# Altium project proj_LAB_main.PrjPcb
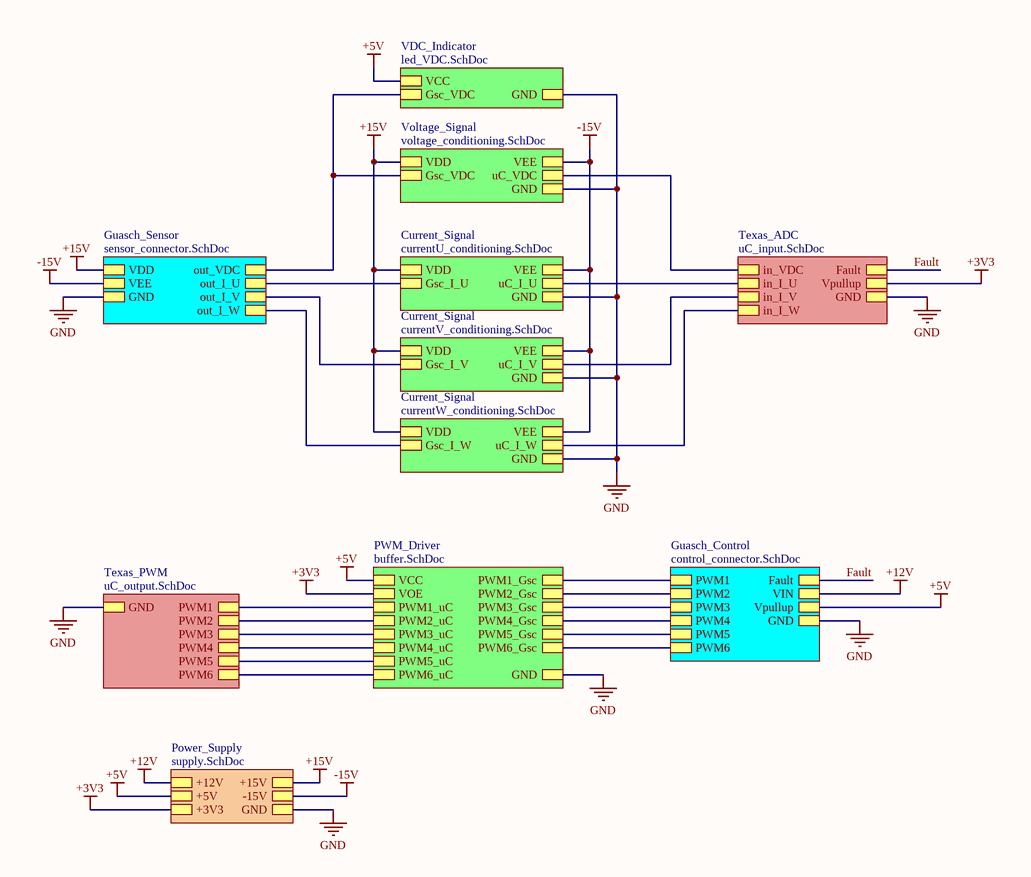
[diagram p0: main.SchDoc]
12 sheets, 130 parts. Net scope: hierarchical (ports join the sheet entries above them; power ports are global).
Sheets:
  main.SchDoc
    PWM_Driver = buffer.SchDoc
    Guasch_Control = control_connector.SchDoc
    Guasch_Sensor = sensor_connector.SchDoc
    Current_Signal = currentU_conditioning.SchDoc
    Voltage_Signal = voltage_conditioning.SchDoc
    Texas_ADC = uC_input.SchDoc
    Texas_PWM = uC_output.SchDoc
    Current_Signal = currentV_conditioning.SchDoc
    Current_Signal = currentW_conditioning.SchDoc
    Power_Supply = supply.SchDoc
    VDC_Indicator = led_VDC.SchDoc

## Sheet main.SchDoc
size A4; SheetNumber: 1; SheetTotal: 12

### Sub-sheets
Current_Signal = currentU_conditioning.SchDoc: Gsc_I_U, uC_I_U, VDD, VEE, GND
Current_Signal = currentV_conditioning.SchDoc: Gsc_I_V, uC_I_V, VDD, VEE, GND
Current_Signal = currentW_conditioning.SchDoc: Gsc_I_W, uC_I_W, VDD, VEE, GND
Guasch_Control = control_connector.SchDoc: PWM1, PWM2, PWM3, Fault, PWM4, PWM5, PWM6, VIN, GND, Vpullup
Guasch_Sensor = sensor_connector.SchDoc: out_I_U, out_I_V, out_I_W, VDD, VEE, GND, out_VDC
Power_Supply = supply.SchDoc: +15V, -15V, +12V, +5V, +3V3, GND
PWM_Driver = buffer.SchDoc: PWM1_uC, PWM2_uC, PWM3_uC, PWM4_uC, PWM5_uC, PWM6_uC, PWM1_Gsc, PWM2_Gsc, PWM3_Gsc, PWM4_Gsc, PWM5_Gsc, PWM6_Gsc, VCC, GND, VOE
Texas_ADC = uC_input.SchDoc: in_VDC, in_I_U, in_I_V, in_I_W, Fault, Vpullup, GND
Texas_PWM = uC_output.SchDoc: PWM1, PWM2, PWM3, PWM4, PWM5, PWM6, GND
VDC_Indicator = led_VDC.SchDoc: VCC, Gsc_VDC, GND
Voltage_Signal = voltage_conditioning.SchDoc: Gsc_VDC, uC_VDC, VDD, VEE, GND

### Nets
+3V3: sheet PWM_Driver/VOE, sheet Texas_ADC/Vpullup, sheet Power_Supply/+3V3
+5V: sheet PWM_Driver/VCC, sheet Guasch_Control/Vpullup, sheet Power_Supply/+5V, sheet VDC_Indicator/VCC
+12V: sheet Guasch_Control/VIN, sheet Power_Supply/+12V
+15V: sheet Guasch_Sensor/VDD, sheet Current_Signal/VDD, sheet Voltage_Signal/VDD, sheet Current_Signal/VDD, sheet Current_Signal/VDD, sheet Power_Supply/+15V
-15V: sheet Guasch_Sensor/VEE, sheet Current_Signal/VEE, sheet Voltage_Signal/VEE, sheet Current_Signal/VEE, sheet Current_Signal/VEE, sheet Power_Supply/-15V
GND: sheet PWM_Driver/GND, sheet Guasch_Control/GND, sheet Guasch_Sensor/GND, sheet Current_Signal/GND, sheet Voltage_Signal/GND, sheet Texas_ADC/GND, sheet Texas_PWM/GND, sheet Current_Signal/GND, sheet Current_Signal/GND, sheet Power_Supply/GND, sheet VDC_Indicator/GND
A/D A2: sheet Voltage_Signal/uC_VDC, sheet Texas_ADC/in_VDC
A/D A3: sheet Current_Signal/uC_I_U, sheet Texas_ADC/in_I_U
A/D A4: sheet Texas_ADC/in_I_V, sheet Current_Signal/uC_I_V
A/D A5: sheet Texas_ADC/in_I_W, sheet Current_Signal/uC_I_W
Fault: sheet Guasch_Control/Fault, sheet Texas_ADC/Fault
Gsc_VDC: sheet Guasch_Sensor/out_VDC, sheet Voltage_Signal/Gsc_VDC, sheet VDC_Indicator/Gsc_VDC
PWM1A: sheet PWM_Driver/PWM1_uC, sheet Texas_PWM/PWM1
PWM2A: sheet PWM_Driver/PWM2_uC, sheet Texas_PWM/PWM2
PWM3A: sheet PWM_Driver/PWM3_uC, sheet Texas_PWM/PWM3
PWM4A: sheet PWM_Driver/PWM4_uC, sheet Texas_PWM/PWM4
PWM5A: sheet PWM_Driver/PWM5_uC, sheet Texas_PWM/PWM5
PWM6A: sheet PWM_Driver/PWM6_uC, sheet Texas_PWM/PWM6
NetIC?#1_3: sheet PWM_Driver/PWM1_Gsc, sheet Guasch_Control/PWM1
NetIC?#1_5: sheet PWM_Driver/PWM2_Gsc, sheet Guasch_Control/PWM2
NetIC?#1_7: sheet PWM_Driver/PWM3_Gsc, sheet Guasch_Control/PWM3
NetIC?#1_9: sheet PWM_Driver/PWM4_Gsc, sheet Guasch_Control/PWM4
NetIC?#1_11: sheet PWM_Driver/PWM5_Gsc, sheet Guasch_Control/PWM5
NetIC?#1_13: sheet PWM_Driver/PWM6_Gsc, sheet Guasch_Control/PWM6
NetJ?#2_3: sheet Guasch_Sensor/out_I_U, sheet Current_Signal/Gsc_I_U
NetJ?#2_4: sheet Guasch_Sensor/out_I_V, sheet Current_Signal/Gsc_I_V
NetJ?#2_5: sheet Guasch_Sensor/out_I_W, sheet Current_Signal/Gsc_I_W

## Sheet buffer.SchDoc
size A4; SheetNumber: 8; SheetTotal: 12
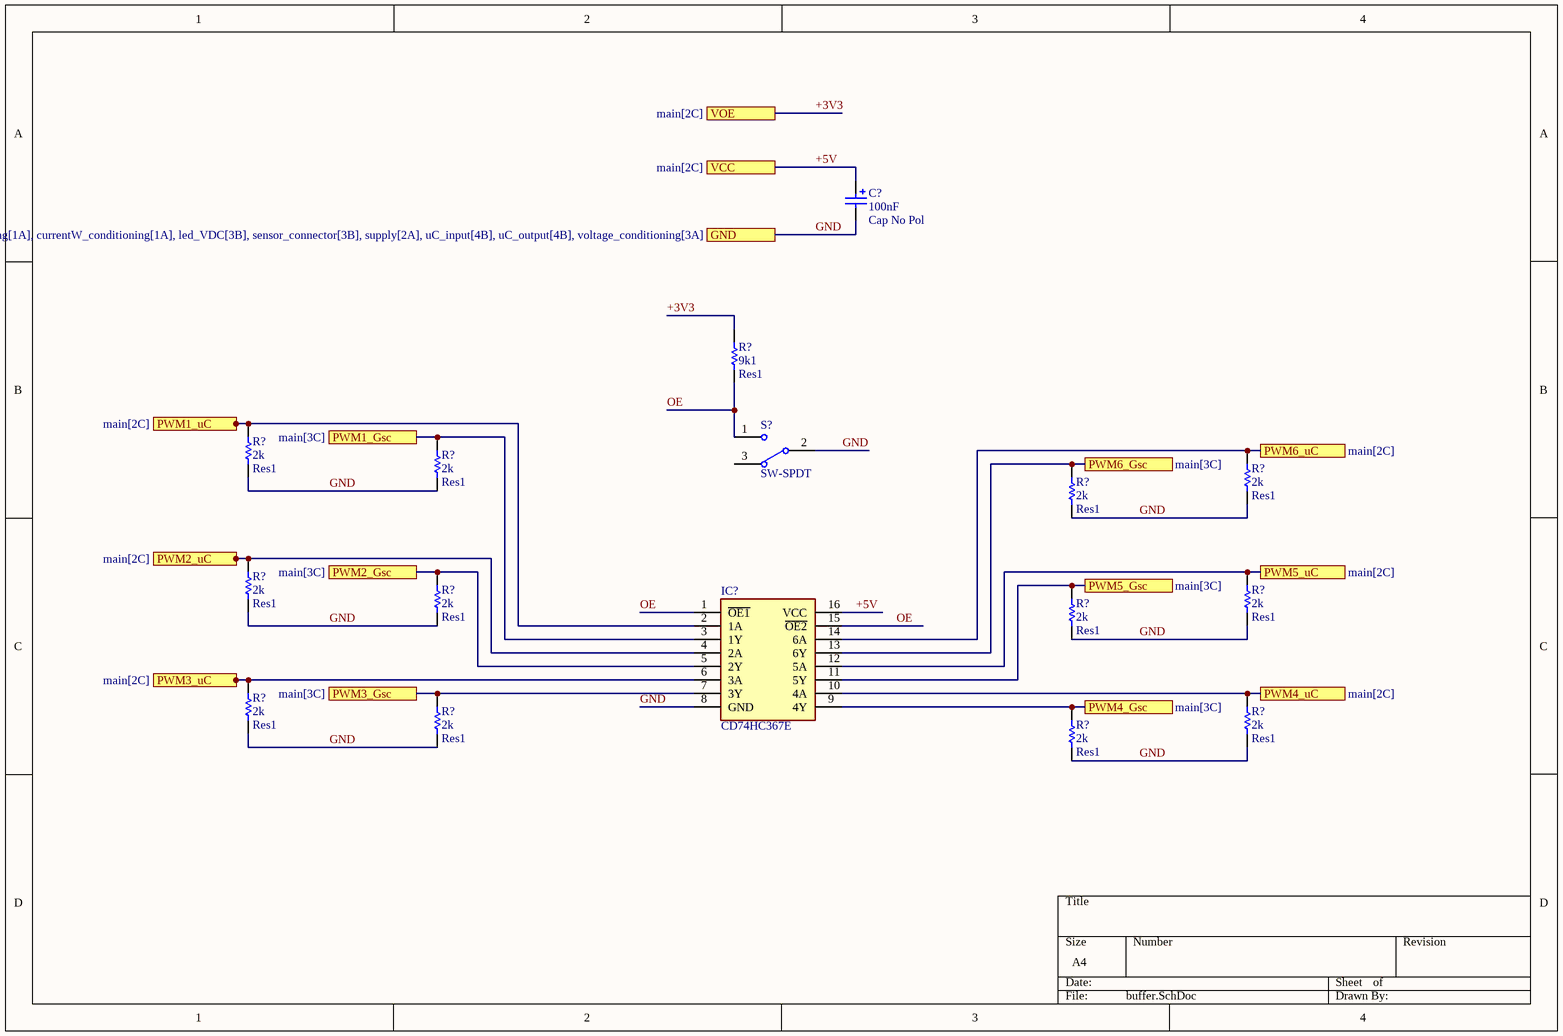
[diagram p1: buffer.SchDoc]

### Parts
(Parts that share a designator on the sheet are numbered #1, #2 ... from top to bottom, then left to right.)
C?#1  Cap No Pol  value 100nF  [RAD-0.1]
IC?#1  CD74HC367E  [DIP794W53P254L1930H508Q16N]
R?#1  Res1  value 9k1  [AXIAL-0.3]
R?#2  Res1  value 2k  [AXIAL-0.3]
R?#3  Res1  value 2k  [AXIAL-0.3]
R?#4  Res1  value 2k  [AXIAL-0.3]
R?#5  Res1  value 2k  [AXIAL-0.3]
R?#6  Res1  value 2k  [AXIAL-0.3]
R?#7  Res1  value 2k  [AXIAL-0.3]
R?#8  Res1  value 2k  [AXIAL-0.3]
R?#9  Res1  value 2k  [AXIAL-0.3]
R?#10  Res1  value 2k  [AXIAL-0.3]
R?#11  Res1  value 2k  [AXIAL-0.3]
R?#12  Res1  value 2k  [AXIAL-0.3]
R?#13  Res1  value 2k  [AXIAL-0.3]
S?#1  SW-SPDT  [MHDR1X3]

### Ports
GND (see main[3C], control_connector[2D], currentU_conditioning[1A], currentV_conditioning[1A], currentW_conditioning[1A], led_VDC[3B], sensor_connector[3B], supply[2A], uC_input[4B], uC_output[4B], voltage_conditioning[3A]), PWM1_Gsc (see main[3C]), PWM1_uC (see main[2C]), PWM2_Gsc (see main[3C]), PWM2_uC (see main[2C]), PWM3_Gsc (see main[3C]), PWM3_uC (see main[2C]), PWM4_Gsc (see main[3C]), PWM4_uC (see main[2C]), PWM5_Gsc (see main[3C]), PWM5_uC (see main[2C]), PWM6_Gsc (see main[3C]), PWM6_uC (see main[2C]), VCC (see main[2C]), VOE (see main[2C])

### Nets
+3V3: R?#1.2 ; port VOE
+5V: C?#1.1 IC?#1.16(VCC) ; port VCC
GND: C?#1.2 IC?#1.8(GND) R?#2.1 R?#3.1 R?#4.1 R?#5.1 R?#6.1 R?#7.1 R?#8.1 R?#9.1 R?#10.1 R?#11.1 R?#12.1 R?#13.1 S?#1.2 ; port GND
OE: IC?#1.1(~{OE1}) IC?#1.15(~{OE2}) R?#1.1 S?#1.1
PWM1A: IC?#1.2(1A) R?#2.2 ; port PWM1_uC
PWM2A: IC?#1.4(2A) R?#6.2 ; port PWM2_uC
PWM3A: IC?#1.6(3A) R?#10.2 ; port PWM3_uC
PWM4A: IC?#1.10(4A) R?#12.2 ; port PWM4_uC
PWM5A: IC?#1.12(5A) R?#8.2 ; port PWM5_uC
PWM6A: IC?#1.14(6A) R?#4.2 ; port PWM6_uC
NetIC?#1_3: IC?#1.3(1Y) R?#3.2 ; port PWM1_Gsc
NetIC?#1_5: IC?#1.5(2Y) R?#7.2 ; port PWM2_Gsc
NetIC?#1_7: IC?#1.7(3Y) R?#11.2 ; port PWM3_Gsc
NetIC?#1_9: IC?#1.9(4Y) R?#13.2 ; port PWM4_Gsc
NetIC?#1_11: IC?#1.11(5Y) R?#9.2 ; port PWM5_Gsc
NetIC?#1_13: IC?#1.13(6Y) R?#5.2 ; port PWM6_Gsc

Not connected (* = marked no-connect by the designer): S?#1 3

### Library data of the parts
C?#1 = Cap No Pol: Polarized Capacitor (Radial); Published: 8-Jun-2000; LatestRevisionDate: 17-Jul-2002; LatestRevisionNote: Re-released for DXP Platform.; PackageReference: RB7.6-15; Publisher: Altium Limited; PackageDescription: Polarized Capacitor (Radial); 2 Leads
IC?#1 = CD74HC367E: Integrated Circuit; Manufacturer_Name: Texas Instruments; Datasheet Link: https://www.ti.com/lit/ds/symlink/cd74hc367.pdf?ts=1619589374451&ref_url=https%253A%252F%252Fwww.ti.com%252Fstore%252Fti%252Fen%252Fp%252Fproduct%252F%253Fp%253DCD74HC367E; Height: 5.08mm; Manufacturer_Part_Number: CD74HC367E; Mouser Part Number: 595-CD74HC367E; Mouser Price/Stock: https://www.mouser.co.uk/ProductDetail/Texas-Instruments/CD74HC367E?qs=xFfolx0DHx1dmtXXzN7naA%3D%3D
R?#1-R?#13 = Res1: Resistor; Published: 8-Jun-2000; LatestRevisionDate: 17-Jul-2002; LatestRevisionNote: Re-released for DXP Platform.; PackageReference: AXIAL-0.3; Publisher: Altium Limited; PackageDescription: Axial Device, Thru-Hole; 2 Leads; 0.3 in Pin Spacing
S?#1 = SW-SPDT: SPDT Subminiature Toggle Switch, Right Angle Mounting, Vertical Actuation; Published: 24-Mar-1999; LatestRevisionDate: 17-Dec-2003; LatestRevisionNote: Schematic revised, PCB Footprint replaced.; DatasheetVersion: 05-Dec-2000; PackageReference: TL36WW15050; Publisher: Altium Limited; PackageDescription: Switch; 4 Leads; ComponentLink1Description: Manufacturer Link; ComponentLink1URL: http://www.apem.com

## Sheet control_connector.SchDoc
size A4; SheetNumber: 7; SheetTotal: 11; SPICEModelCacheRONAVTZR: <root> / <DocumentId>RONAVTZR</DocumentId> / </root>
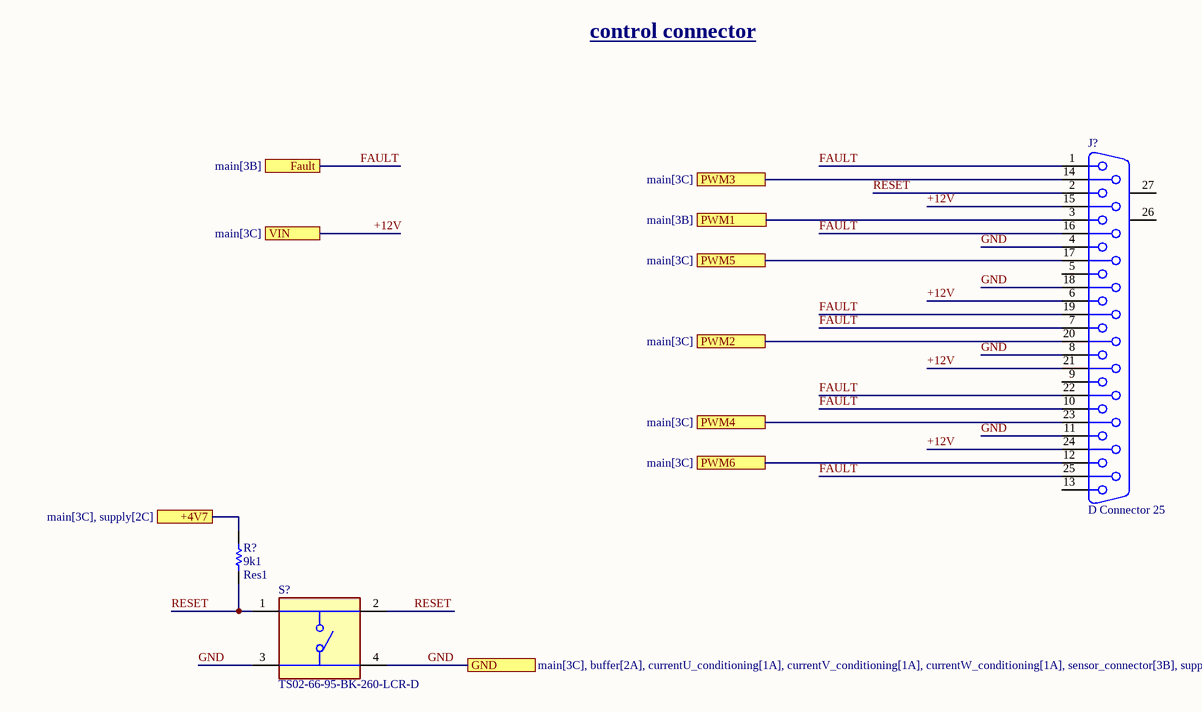
[diagram p2: control_connector.SchDoc]

### Parts
(Parts that share a designator on the sheet are numbered #1, #2 ... from top to bottom, then left to right.)
J?#1  D Connector 25  [DSUB1.385-2H25A]
R?#14  Res1  value 9k1  [AXIAL-0.3]
S?#2  TS02-66-95-BK-260-LCR-D  [SW_TS02-66-95-BK-260-LCR-D]

### Ports
+4V7 (see main[3C], supply[2C]), Fault (see main[3B]), GND (see main[3C], buffer[2A], currentU_conditioning[1A], currentV_conditioning[1A], currentW_conditioning[1A], sensor_connector[3B], supply[2A], uC_input[4B], uC_output[4B], voltage_conditioning[2A]), PWM1 (see main[3B]), PWM2 (see main[3C]), PWM3 (see main[3C]), PWM4 (see main[3C]), PWM5 (see main[3C]), PWM6 (see main[3C]), VIN (see main[3C])

### Nets
+12V: J?#1.6 J?#1.15 J?#1.21 J?#1.24 ; port VIN
GND: J?#1.4 J?#1.8 J?#1.11 J?#1.18 S?#2.3 S?#2.4 ; port GND
Fault: J?#1.1 J?#1.7 J?#1.10 J?#1.16 J?#1.19 J?#1.22 J?#1.25 ; port Fault
RESET: J?#1.2 R?#14.1 S?#2.1 S?#2.2
NetIC?#1_3: J?#1.3 ; port PWM1
NetIC?#1_5: J?#1.20 ; port PWM2
NetIC?#1_7: J?#1.14 ; port PWM3
NetIC?#1_9: J?#1.23 ; port PWM4
NetIC?#1_11: J?#1.17 ; port PWM5
NetIC?#1_13: J?#1.12 ; port PWM6
NetR?#14_2: R?#14.2 ; port +4V7

Not connected (* = marked no-connect by the designer): J?#1 5 9 13 26(MH1) 27(MH2)

### Notes on the sheet
- control connector

### Library data of the parts
J?#1 = D Connector 25: Receptacle Assembly, 25 Position, Right Angle; PackageDocument: U; Positions: 25; Published: 15-Jun-2001; LatestRevisionDate: 17-Jul-2002; LatestRevisionNote: Re-released for DXP Platform.; DatasheetDocument: 19-Mar-1999; PackageReference: 787202; Publisher: Altium Limited; Orientation: Right Angle; Gender: Receptacle
R?#14 = Res1: Resistor; Published: 8-Jun-2000; LatestRevisionDate: 17-Jul-2002; LatestRevisionNote: Re-released for DXP Platform.; PackageReference: AXIAL-0.3; Publisher: Altium Limited; PackageDescription: Axial Device, Thru-Hole; 2 Leads; 0.3 in Pin Spacing
S?#2 = TS02-66-95-BK-260-LCR-D: Price: None; Availability: Unavailable; MP: TS02-66-95-BK-260-LCR-D; Value: *; Package: None

## Sheet sensor_connector.SchDoc
size A4; SheetNumber: 7; SheetTotal: 7
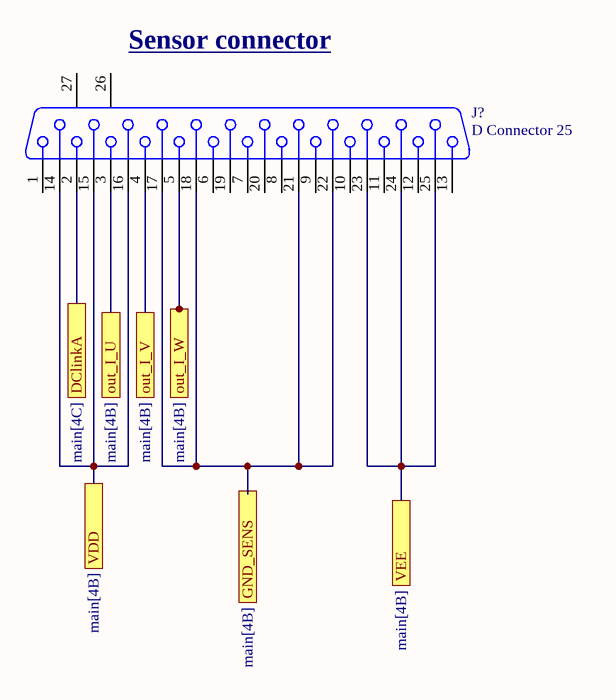
[diagram p3: sensor_connector.SchDoc]

### Parts
(Parts that share a designator on the sheet are numbered #1, #2 ... from top to bottom, then left to right.)
J?#2  D Connector 25  [DSUB1.385-2H25A]

### Ports
DClinkA (see main[4C]), GND_SENS (see main[4B]), out_I_U (see main[4B]), out_I_V (see main[4B]), out_I_W (see main[4B]), VDD (see main[4B]), VEE (see main[4B])

### Nets
+15V: J?#2.14 J?#2.15 J?#2.16 ; port VDD
-15V: J?#2.23 J?#2.24 J?#2.25 ; port VEE
NetJ?#2_2: J?#2.2 ; port DClinkA
NetJ?#2_3: J?#2.3 ; port out_I_U
NetJ?#2_4: J?#2.4 ; port out_I_V
NetJ?#2_5: J?#2.5 ; port out_I_W
NetJ?#2_17: J?#2.17 J?#2.18 J?#2.21 J?#2.22 ; port GND_SENS

Not connected (* = marked no-connect by the designer): J?#2 1 6 7 8 9 10 11 12 13 19 20 26(MH1) 27(MH2)

### Notes on the sheet
- (near J?#2) Sensor connector

### Library data of the parts
J?#2 = D Connector 25: as J?#1 on sheet control_connector; Published: 15-Jun-2001; LatestRevisionDate: 17-Jul-2002; LatestRevisionNote: Re-released for DXP Platform.; DatasheetDocument: 19-Mar-1999; PackageReference: 787202; Publisher: Altium Limited; Orientation: Right Angle; Gender: Receptacle

## Sheet currentU_conditioning.SchDoc
size A4; SheetNumber: 2; SheetTotal: 12; SPICEModelCacheJNOYGZHY: <root> / <DocumentId>JNOYGZHY</DocumentId> / </root>
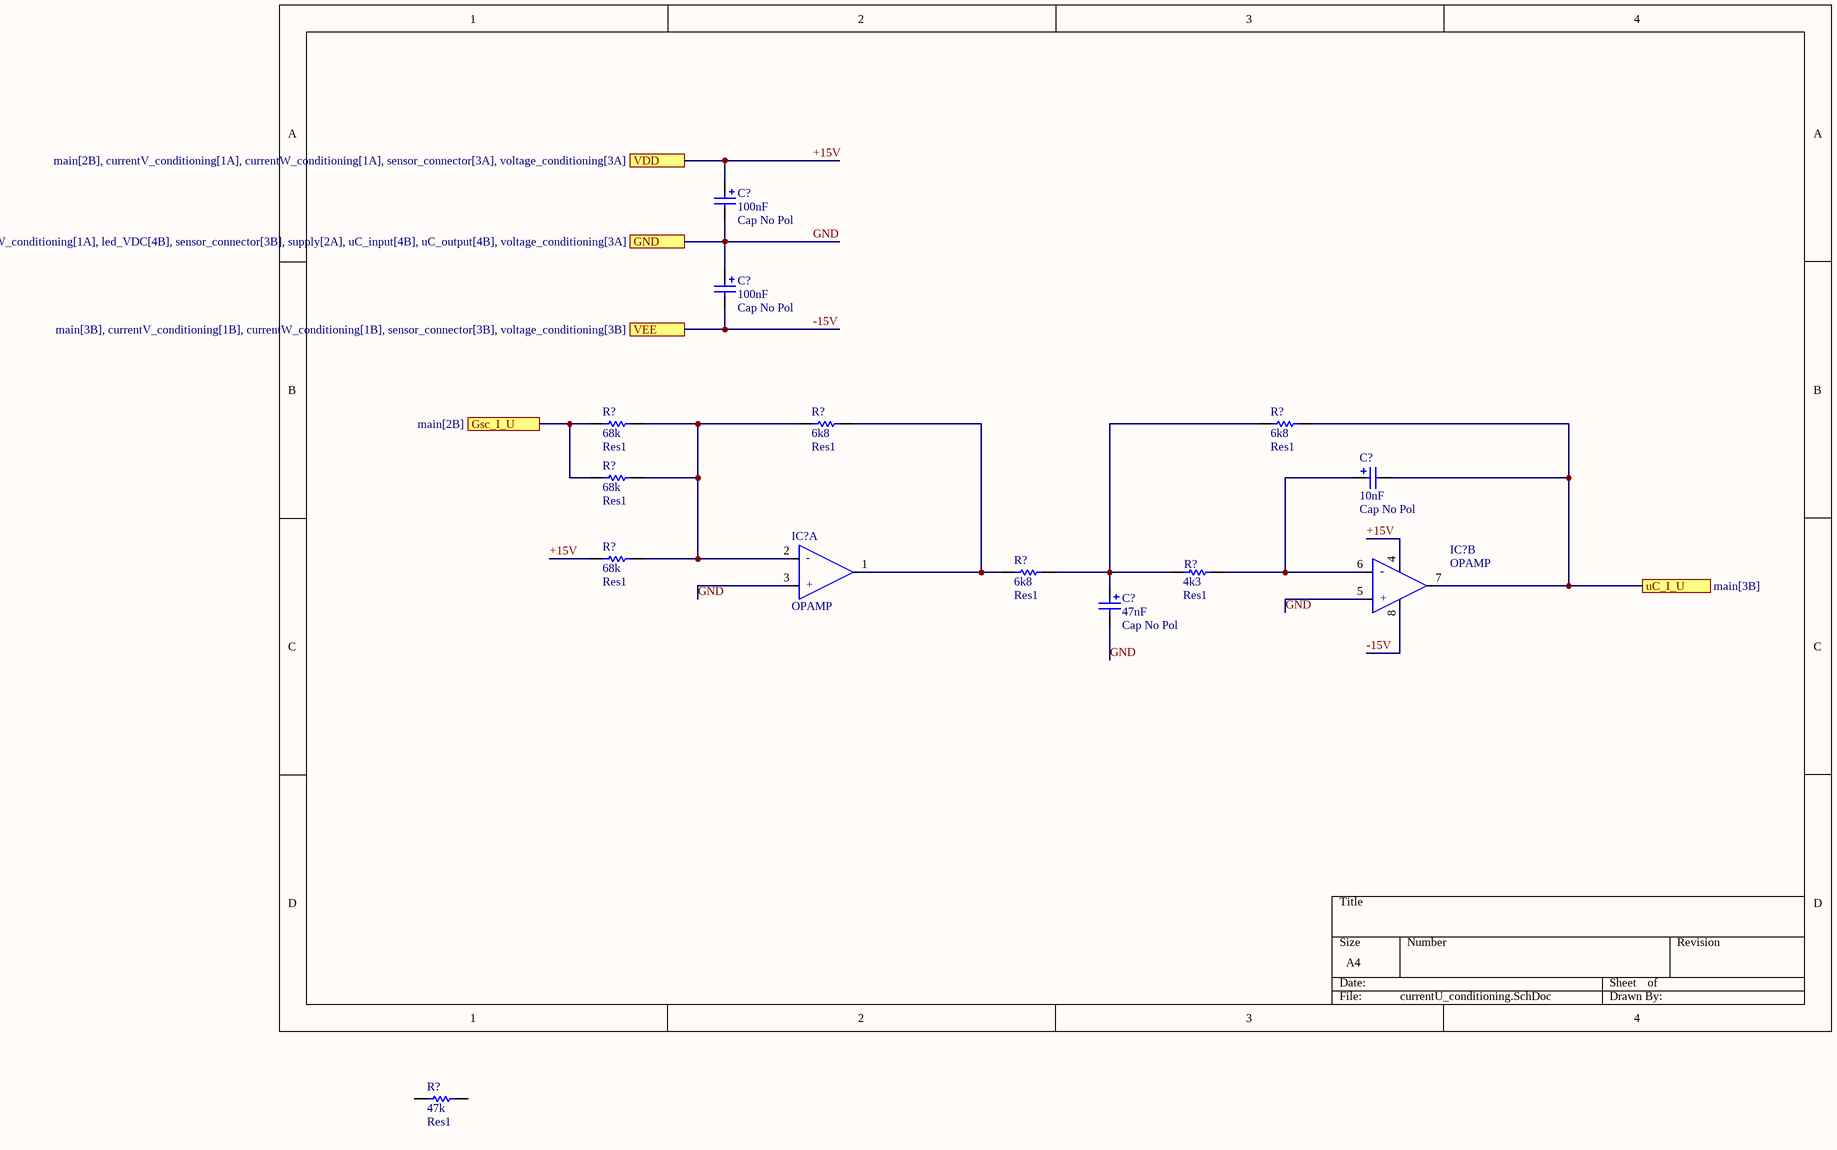
[diagram p4: currentU_conditioning.SchDoc]

### Parts
(Parts that share a designator on the sheet are numbered #1, #2 ... from top to bottom, then left to right.)
C?#2  Cap No Pol  value 100nF  [RAD-0.1]
C?#3  Cap No Pol  value 100nF  [RAD-0.1]
C?#4  Cap No Pol  value 10nF  [RAD-0.1]
C?#5  Cap No Pol  value 47nF  [RAD-0.1]
IC?#2  OPAMP  [DIP-8]  (part A of 2)
IC?#3  OPAMP  [DIP-8]  (part B of 2)
R?#15  Res1  value 68k  [AXIAL-0.3]
R?#16  Res1  value 6k8  [AXIAL-0.3]
R?#17  Res1  value 6k8  [AXIAL-0.3]
R?#18  Res1  value 68k  [AXIAL-0.3]
R?#19  Res1  value 68k  [AXIAL-0.3]
R?#20  Res1  value 6k8  [AXIAL-0.3]
R?#21  Res1  value 4k3  [AXIAL-0.3]
R?#22  Res1  value 47k  [AXIAL-0.3]

### Ports
GND (see main[3B], buffer[2A], control_connector[2D], currentV_conditioning[1A], currentW_conditioning[1A], led_VDC[4B], sensor_connector[3B], supply[2A], uC_input[4B], uC_output[4B], voltage_conditioning[3A]), Gsc_I_U (see main[2B]), uC_I_U (see main[3B]), VDD (see main[2B], currentV_conditioning[1A], currentW_conditioning[1A], sensor_connector[3A], voltage_conditioning[3A]), VEE (see main[3B], currentV_conditioning[1B], currentW_conditioning[1B], sensor_connector[3B], voltage_conditioning[3B])

### Nets
+15V: C?#2.1 IC?#3.4(-V) R?#19.1 ; port VDD
-15V: C?#3.2 IC?#3.8(V+) ; port VEE
GND: C?#2.2 C?#3.1 C?#5.2 IC?#2.3(IN_A_+) IC?#3.5(IN_B_+) ; port GND
A/D A3: C?#4.2 IC?#3.7(OUT_B) R?#17.2 ; port uC_I_U
NetC?#4_1: C?#4.1 IC?#3.6(IN_B_-) R?#21.2
NetC?#5_1: C?#5.1 R?#17.1 R?#20.2 R?#21.1
NetIC?#2_1: IC?#2.1(OUT_A) R?#16.2 R?#20.1
NetIC?#2_2: IC?#2.2(IN_A_-) R?#15.2 R?#16.1 R?#18.2 R?#19.2
NetJ?#2_3: R?#15.1 R?#18.1 ; port Gsc_I_U

Not connected (* = marked no-connect by the designer): R?#22 1 2

### Notes on the sheet
- (in symbol ADTL082, part A) -; +
- (in symbol ADTL082, part B) -; +

### Library data of the parts
C?#2-C?#5 = Cap No Pol: Polarized Capacitor (Radial); Published: 8-Jun-2000; LatestRevisionDate: 17-Jul-2002; LatestRevisionNote: Re-released for DXP Platform.; PackageReference: RB7.6-15; Publisher: Altium Limited; PackageDescription: Polarized Capacitor (Radial); 2 Leads
IC?#2 IC?#3 = ADTL082
R?#15-R?#22 = Res1: Resistor; Published: 8-Jun-2000; LatestRevisionDate: 17-Jul-2002; LatestRevisionNote: Re-released for DXP Platform.; PackageReference: AXIAL-0.3; Publisher: Altium Limited; PackageDescription: Axial Device, Thru-Hole; 2 Leads; 0.3 in Pin Spacing

## Sheet voltage_conditioning.SchDoc
size A4; SheetNumber: 5; SheetTotal: 12
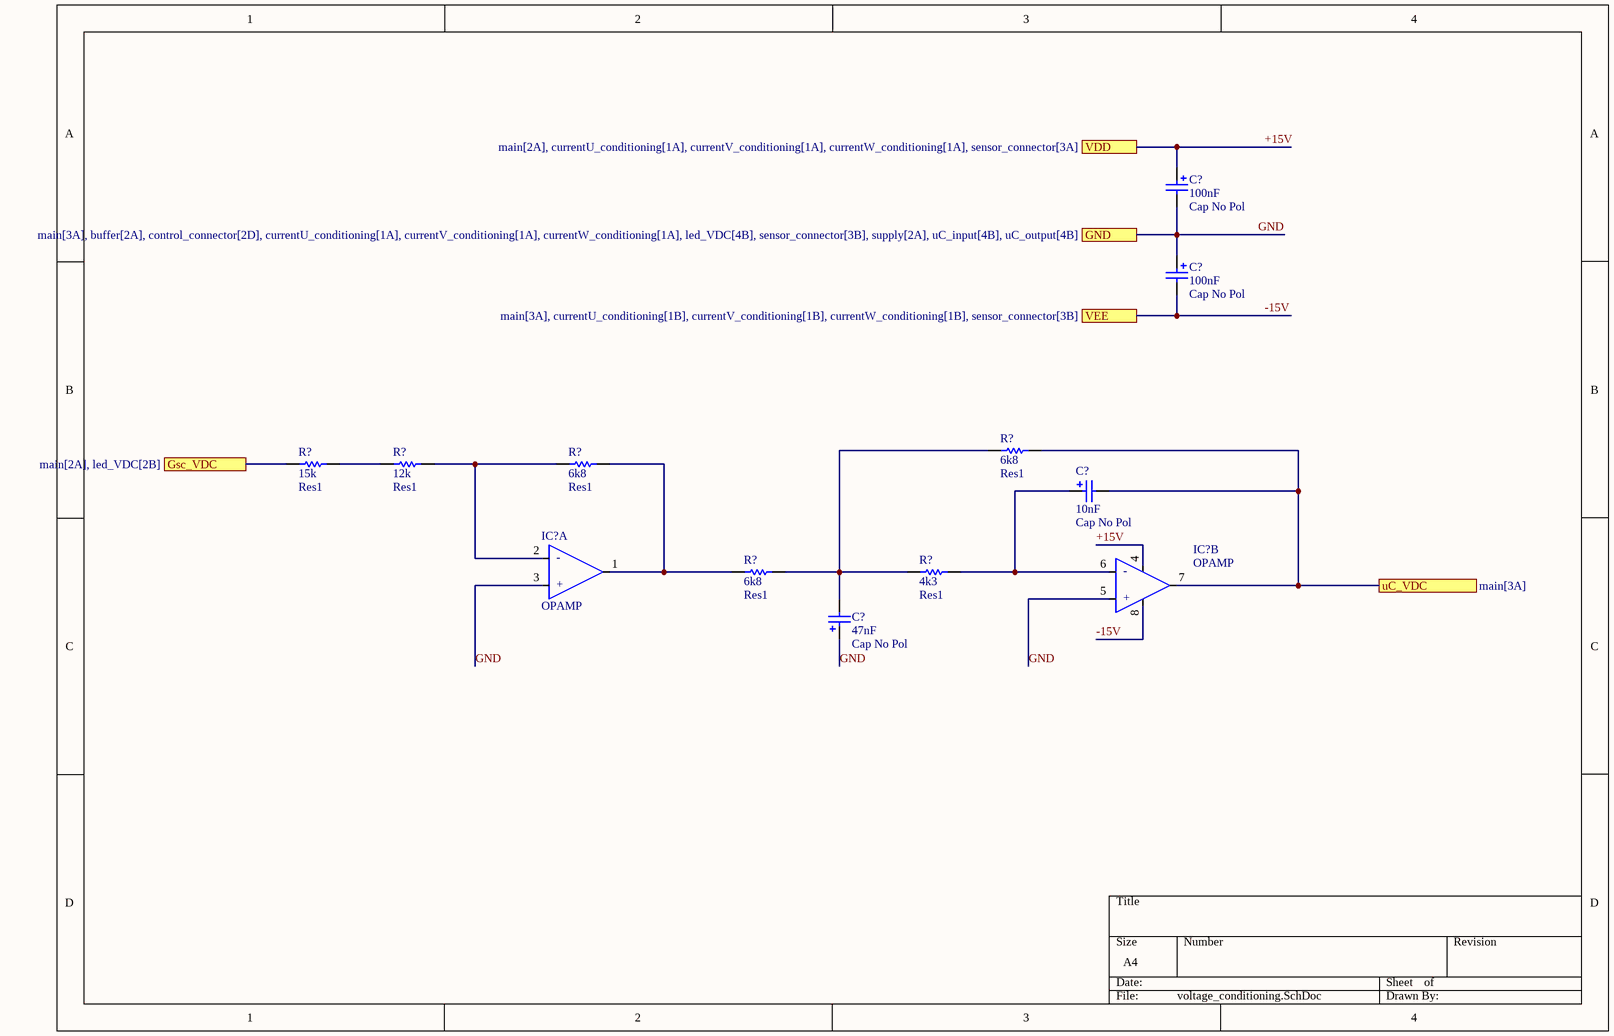
[diagram p5: voltage_conditioning.SchDoc]

### Parts
(Parts that share a designator on the sheet are numbered #1, #2 ... from top to bottom, then left to right.)
C?#6  Cap No Pol  value 100nF  [RAD-0.1]
C?#7  Cap No Pol  value 100nF  [RAD-0.1]
C?#8  Cap No Pol  value 10nF  [RAD-0.1]
C?#9  Cap No Pol  value 47nF  [RAD-0.1]
IC?#4  OPAMP  [DIP-8]  (part A of 2)
IC?#5  OPAMP  [DIP-8]  (part B of 2)
R?#23  Res1  value 6k8  [AXIAL-0.3]
R?#24  Res1  value 15k  [AXIAL-0.3]
R?#25  Res1  value 12k  [AXIAL-0.3]
R?#26  Res1  value 6k8  [AXIAL-0.3]
R?#27  Res1  value 6k8  [AXIAL-0.3]
R?#28  Res1  value 4k3  [AXIAL-0.3]

### Ports
GND (see main[3A], buffer[2A], control_connector[2D], currentU_conditioning[1A], currentV_conditioning[1A], currentW_conditioning[1A], led_VDC[4B], sensor_connector[3B], supply[2A], uC_input[4B], uC_output[4B]), Gsc_VDC (see main[2A], led_VDC[2B]), uC_VDC (see main[3A]), VDD (see main[2A], currentU_conditioning[1A], currentV_conditioning[1A], currentW_conditioning[1A], sensor_connector[3A]), VEE (see main[3A], currentU_conditioning[1B], currentV_conditioning[1B], currentW_conditioning[1B], sensor_connector[3B])

### Nets
+15V: C?#6.1 IC?#5.4(-V) ; port VDD
-15V: C?#7.2 IC?#5.8(V+) ; port VEE
GND: C?#6.2 C?#7.1 C?#9.1 IC?#4.3(IN_A_+) IC?#5.5(IN_B_+) ; port GND
A/D A2: C?#8.2 IC?#5.7(OUT_B) R?#23.2 ; port uC_VDC
Gsc_VDC: R?#24.1 ; port Gsc_VDC
NetC?#8_1: C?#8.1 IC?#5.6(IN_B_-) R?#28.2
NetC?#9_2: C?#9.2 R?#23.1 R?#27.2 R?#28.1
NetIC?#4_1: IC?#4.1(OUT_A) R?#26.2 R?#27.1
NetIC?#4_2: IC?#4.2(IN_A_-) R?#25.2 R?#26.1
NetR?#24_2: R?#24.2 R?#25.1

### Notes on the sheet
- (in symbol ADTL082, part A) -; +
- (in symbol ADTL082, part B) -; +

### Library data of the parts
C?#6-C?#9 = Cap No Pol: Polarized Capacitor (Radial); Published: 8-Jun-2000; LatestRevisionDate: 17-Jul-2002; LatestRevisionNote: Re-released for DXP Platform.; PackageReference: RB7.6-15; Publisher: Altium Limited; PackageDescription: Polarized Capacitor (Radial); 2 Leads
IC?#4 IC?#5 = ADTL082
R?#23-R?#28 = Res1: Resistor; Published: 8-Jun-2000; LatestRevisionDate: 17-Jul-2002; LatestRevisionNote: Re-released for DXP Platform.; PackageReference: AXIAL-0.3; Publisher: Altium Limited; PackageDescription: Axial Device, Thru-Hole; 2 Leads; 0.3 in Pin Spacing

## Sheet uC_input.SchDoc
size A; SheetNumber: 10; SheetTotal: 12; SPICEModelCacheXWDQNBJN: <root> / <DocumentId>XWDQNBJN</DocumentId> / <CacheFrame Number="0"> / <Model Name="led0" Kind="MDL"> / <Text>*Typ INFRARED GaAs LED: Vf=1.2V Vr=5V If=40mA trr=3uS / *LED Pinout: 1=A, 2=K / .MODEL LED0 D (IS=93.5P RS=84M N=2.63 BV=5 IBV=10U / + CJO=2.97P VJ=.75 M=.333 TT=4.32U)</Text> / </Model> / </CacheFrame> / </root>
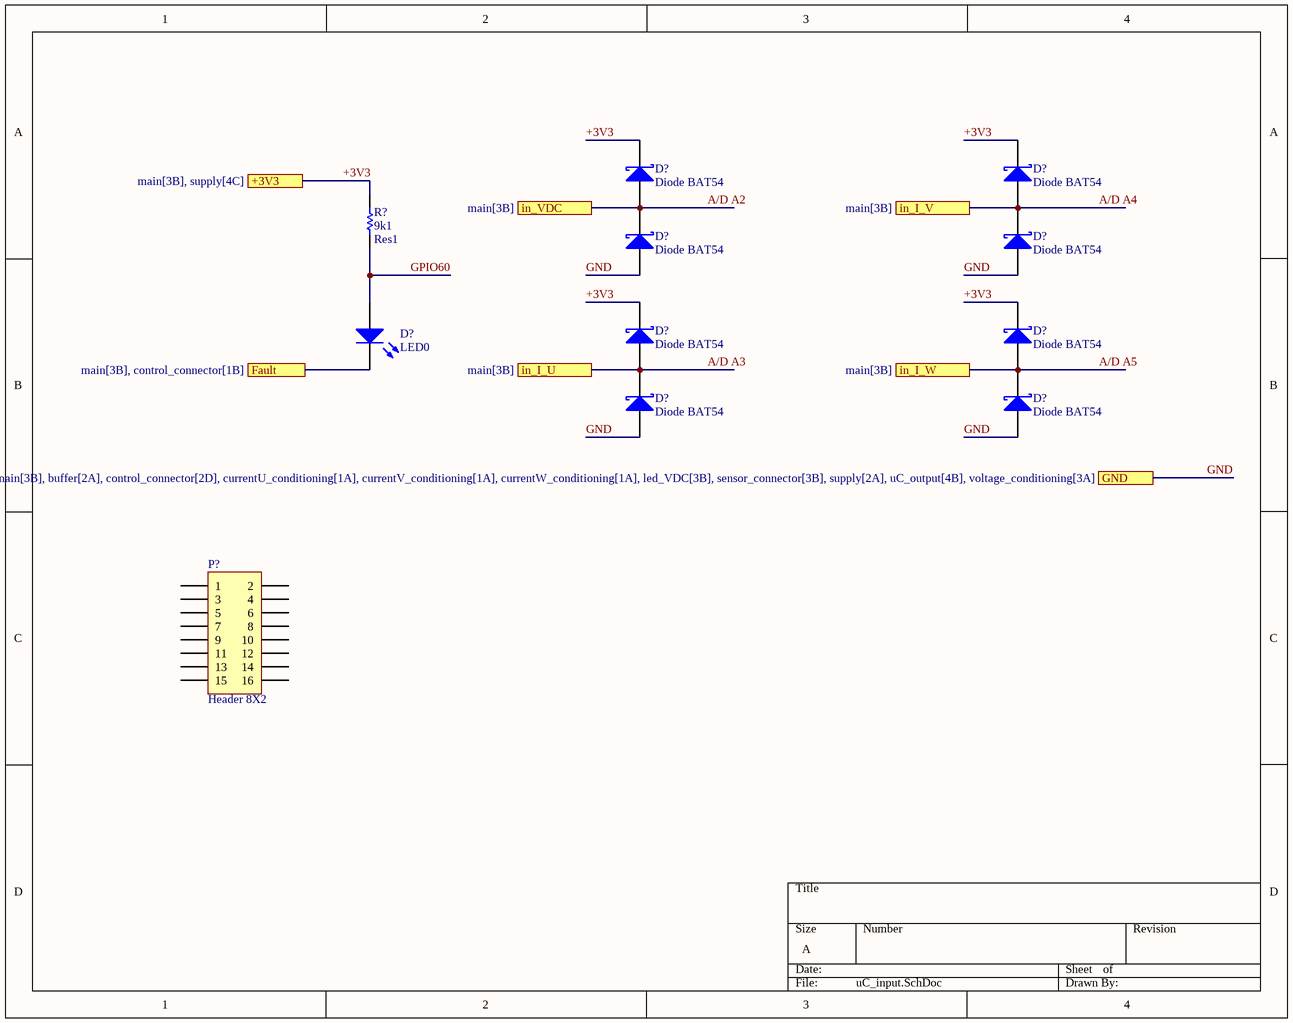
[diagram p6: uC_input.SchDoc]

### Parts
(Parts that share a designator on the sheet are numbered #1, #2 ... from top to bottom, then left to right.)
D?#1  Diode BAT54  [DO-204AL]
D?#2  Diode BAT54  [DO-204AL]
D?#3  Diode BAT54  [DO-204AL]
D?#4  Diode BAT54  [DO-204AL]
D?#5  LED0  [LED-0]
D?#6  Diode BAT54  [DO-204AL]
D?#7  Diode BAT54  [DO-204AL]
D?#8  Diode BAT54  [DO-204AL]
D?#9  Diode BAT54  [DO-204AL]
P?#1  Header 8X2  [HDR2X8]
R?#29  Res1  value 9k1  [AXIAL-0.3]

### Ports
+3V3 (see main[3B], supply[4C]), Fault (see main[3B], control_connector[1B]), GND (see main[3B], buffer[2A], control_connector[2D], currentU_conditioning[1A], currentV_conditioning[1A], currentW_conditioning[1A], led_VDC[3B], sensor_connector[3B], supply[2A], uC_output[4B], voltage_conditioning[3A]), in_I_U (see main[3B]), in_I_V (see main[3B]), in_I_W (see main[3B]), in_VDC (see main[3B])

### Nets
GND: D?#3.1(A) D?#4.1(A) D?#8.1(A) D?#9.1(A) ; port GND
+3V3: D?#1.2(K) D?#2.2(K) D?#6.2(K) D?#7.2(K) R?#29.2 ; port +3V3
A/D A2: D?#1.1(A) D?#3.2(K) ; port in_VDC
A/D A3: D?#6.1(A) D?#8.2(K) ; port in_I_U
A/D A4: D?#2.1(A) D?#4.2(K) ; port in_I_V
A/D A5: D?#7.1(A) D?#9.2(K) ; port in_I_W
Fault: D?#5.2(K) ; port Fault
GPIO60: D?#5.1(A) R?#29.1

Not connected (* = marked no-connect by the designer): P?#1 1 2 3 4 5 6 7 8 9 10 11 12 13 14 15 16

### Library data of the parts
D?#1-D?#4 D?#6-D?#9 = Diode 11DQ03: Schottky Rectifier; Published: 8-Jun-2000; LatestRevisionDate: 17-Jul-2002; LatestRevisionNote: Re-released for DXP Platform.; DatasheetVersion: Dec-1997; PackageReference: DO-204AL; Publisher: Altium Limited; PackageDescription: Diode, Axial; Body 5.2 x 2.7 mm (LxDia. max), Lead Dia. 0.86 mm (max); Code_JEDEC: DO-204-AL; ComponentLink1Description: Manufacturer Link; ComponentLink1URL: http://www.irf.com/; ComponentLink2Description: Datasheet; ComponentLink2URL: http://www.irf.com/product-info/datasheets/data/11dq03.pdf
D?#5 = LED0: Typical INFRARED GaAs LED; Published: 8-Jun-2000; LatestRevisionDate: 08-Jul-2005; LatestRevisionNote: Mech Layer 1 removed.; PackageReference: LED-0; Publisher: Altium Limited; PackageDescription: LED; 2 Leads
P?#1 = Header 8X2: Header, 8-Pin, Dual row; LatestRevisionDate: 17-Jul-2002; LatestRevisionNote: Re-released for DXP Platform.; Publisher: Altium Limited
R?#29 = Res1: Resistor; Published: 8-Jun-2000; LatestRevisionDate: 17-Jul-2002; LatestRevisionNote: Re-released for DXP Platform.; PackageReference: AXIAL-0.3; Publisher: Altium Limited; PackageDescription: Axial Device, Thru-Hole; 2 Leads; 0.3 in Pin Spacing

## Sheet uC_output.SchDoc
size A; SheetNumber: 11; SheetTotal: 11
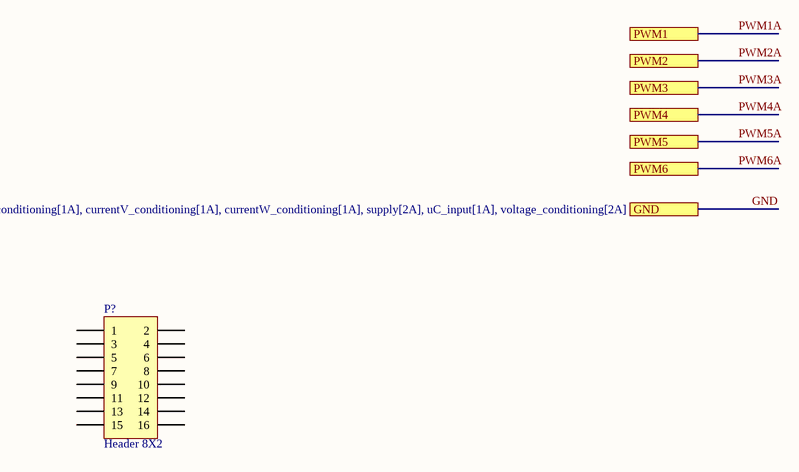
[diagram p7: uC_output.SchDoc]

### Parts
(Parts that share a designator on the sheet are numbered #1, #2 ... from top to bottom, then left to right.)
P?#2  Header 8X2  [HDR2X8]

### Ports
GND (see main[1C], buffer[2A], control_connector[2D], currentU_conditioning[1A], currentV_conditioning[1A], currentW_conditioning[1A], supply[2A], uC_input[1A], voltage_conditioning[2A]), PWM1, PWM2, PWM3, PWM4, PWM5, PWM6

### Nets

Not connected (* = marked no-connect by the designer): P?#2 1 2 3 4 5 6 7 8 9 10 11 12 13 14 15 16

### Library data of the parts
P?#2 = Header 8X2: Header, 8-Pin, Dual row; LatestRevisionDate: 17-Jul-2002; LatestRevisionNote: Re-released for DXP Platform.; Publisher: Altium Limited

## Sheet currentV_conditioning.SchDoc
size A4; SheetNumber: 3; SheetTotal: 12; SPICEModelCacheJNOYGZHY: <root> / <DocumentId>JNOYGZHY</DocumentId> / </root>
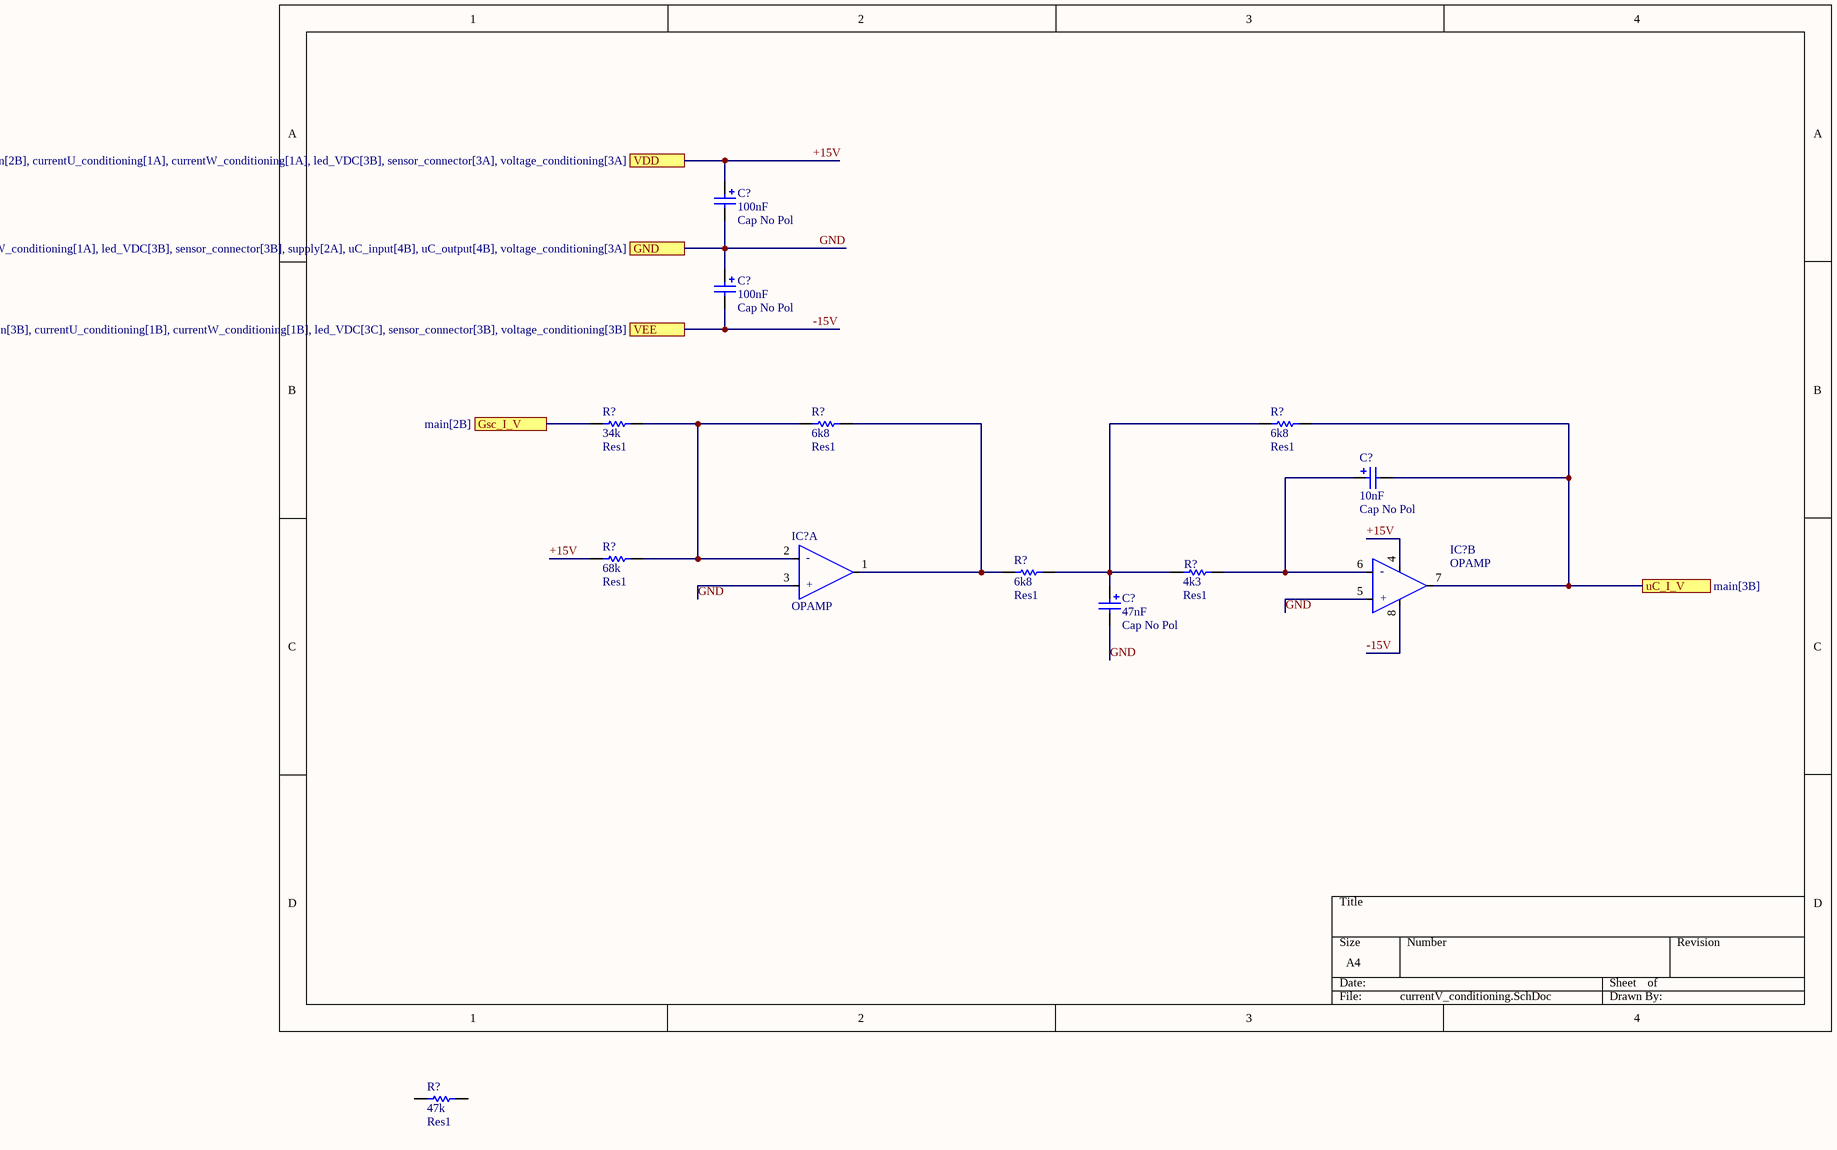
[diagram p8: currentV_conditioning.SchDoc]

### Parts
(Parts that share a designator on the sheet are numbered #1, #2 ... from top to bottom, then left to right.)
C?#10  Cap No Pol  value 100nF  [RAD-0.1]
C?#11  Cap No Pol  value 100nF  [RAD-0.1]
C?#12  Cap No Pol  value 10nF  [RAD-0.1]
C?#13  Cap No Pol  value 47nF  [RAD-0.1]
IC?#6  OPAMP  [DIP-8]  (part A of 2)
IC?#7  OPAMP  [DIP-8]  (part B of 2)
R?#30  Res1  value 34k  [AXIAL-0.3]
R?#31  Res1  value 6k8  [AXIAL-0.3]
R?#32  Res1  value 6k8  [AXIAL-0.3]
R?#33  Res1  value 68k  [AXIAL-0.3]
R?#34  Res1  value 6k8  [AXIAL-0.3]
R?#35  Res1  value 4k3  [AXIAL-0.3]
R?#36  Res1  value 47k  [AXIAL-0.3]

### Ports
GND (see main[3B], buffer[2A], control_connector[2D], currentU_conditioning[1A], currentW_conditioning[1A], led_VDC[3B], sensor_connector[3B], supply[2A], uC_input[4B], uC_output[4B], voltage_conditioning[3A]), Gsc_I_V (see main[2B]), uC_I_V (see main[3B]), VDD (see main[2B], currentU_conditioning[1A], currentW_conditioning[1A], led_VDC[3B], sensor_connector[3A], voltage_conditioning[3A]), VEE (see main[3B], currentU_conditioning[1B], currentW_conditioning[1B], led_VDC[3C], sensor_connector[3B], voltage_conditioning[3B])

### Nets
+15V: C?#10.1 IC?#7.4(-V) R?#33.1 ; port VDD
-15V: C?#11.2 IC?#7.8(V+) ; port VEE
GND: C?#10.2 C?#11.1 C?#13.2 IC?#6.3(IN_A_+) IC?#7.5(IN_B_+) ; port GND
A/D A4: C?#12.2 IC?#7.7(OUT_B) R?#32.2 ; port uC_I_V
NetC?#12_1: C?#12.1 IC?#7.6(IN_B_-) R?#35.2
NetC?#13_1: C?#13.1 R?#32.1 R?#34.2 R?#35.1
NetIC?#6_1: IC?#6.1(OUT_A) R?#31.2 R?#34.1
NetIC?#6_2: IC?#6.2(IN_A_-) R?#30.2 R?#31.1 R?#33.2
NetJ?#2_4: R?#30.1 ; port Gsc_I_V

Not connected (* = marked no-connect by the designer): R?#36 1 2

### Notes on the sheet
- (in symbol ADTL082, part A) -; +
- (in symbol ADTL082, part B) -; +

### Library data of the parts
C?#10-C?#13 = Cap No Pol: Polarized Capacitor (Radial); Published: 8-Jun-2000; LatestRevisionDate: 17-Jul-2002; LatestRevisionNote: Re-released for DXP Platform.; PackageReference: RB7.6-15; Publisher: Altium Limited; PackageDescription: Polarized Capacitor (Radial); 2 Leads
IC?#6 IC?#7 = ADTL082
R?#30-R?#36 = Res1: Resistor; Published: 8-Jun-2000; LatestRevisionDate: 17-Jul-2002; LatestRevisionNote: Re-released for DXP Platform.; PackageReference: AXIAL-0.3; Publisher: Altium Limited; PackageDescription: Axial Device, Thru-Hole; 2 Leads; 0.3 in Pin Spacing

## Sheet currentW_conditioning.SchDoc
size A4; SheetNumber: 4; SheetTotal: 12; SPICEModelCacheJNOYGZHY: <root> / <DocumentId>JNOYGZHY</DocumentId> / </root>
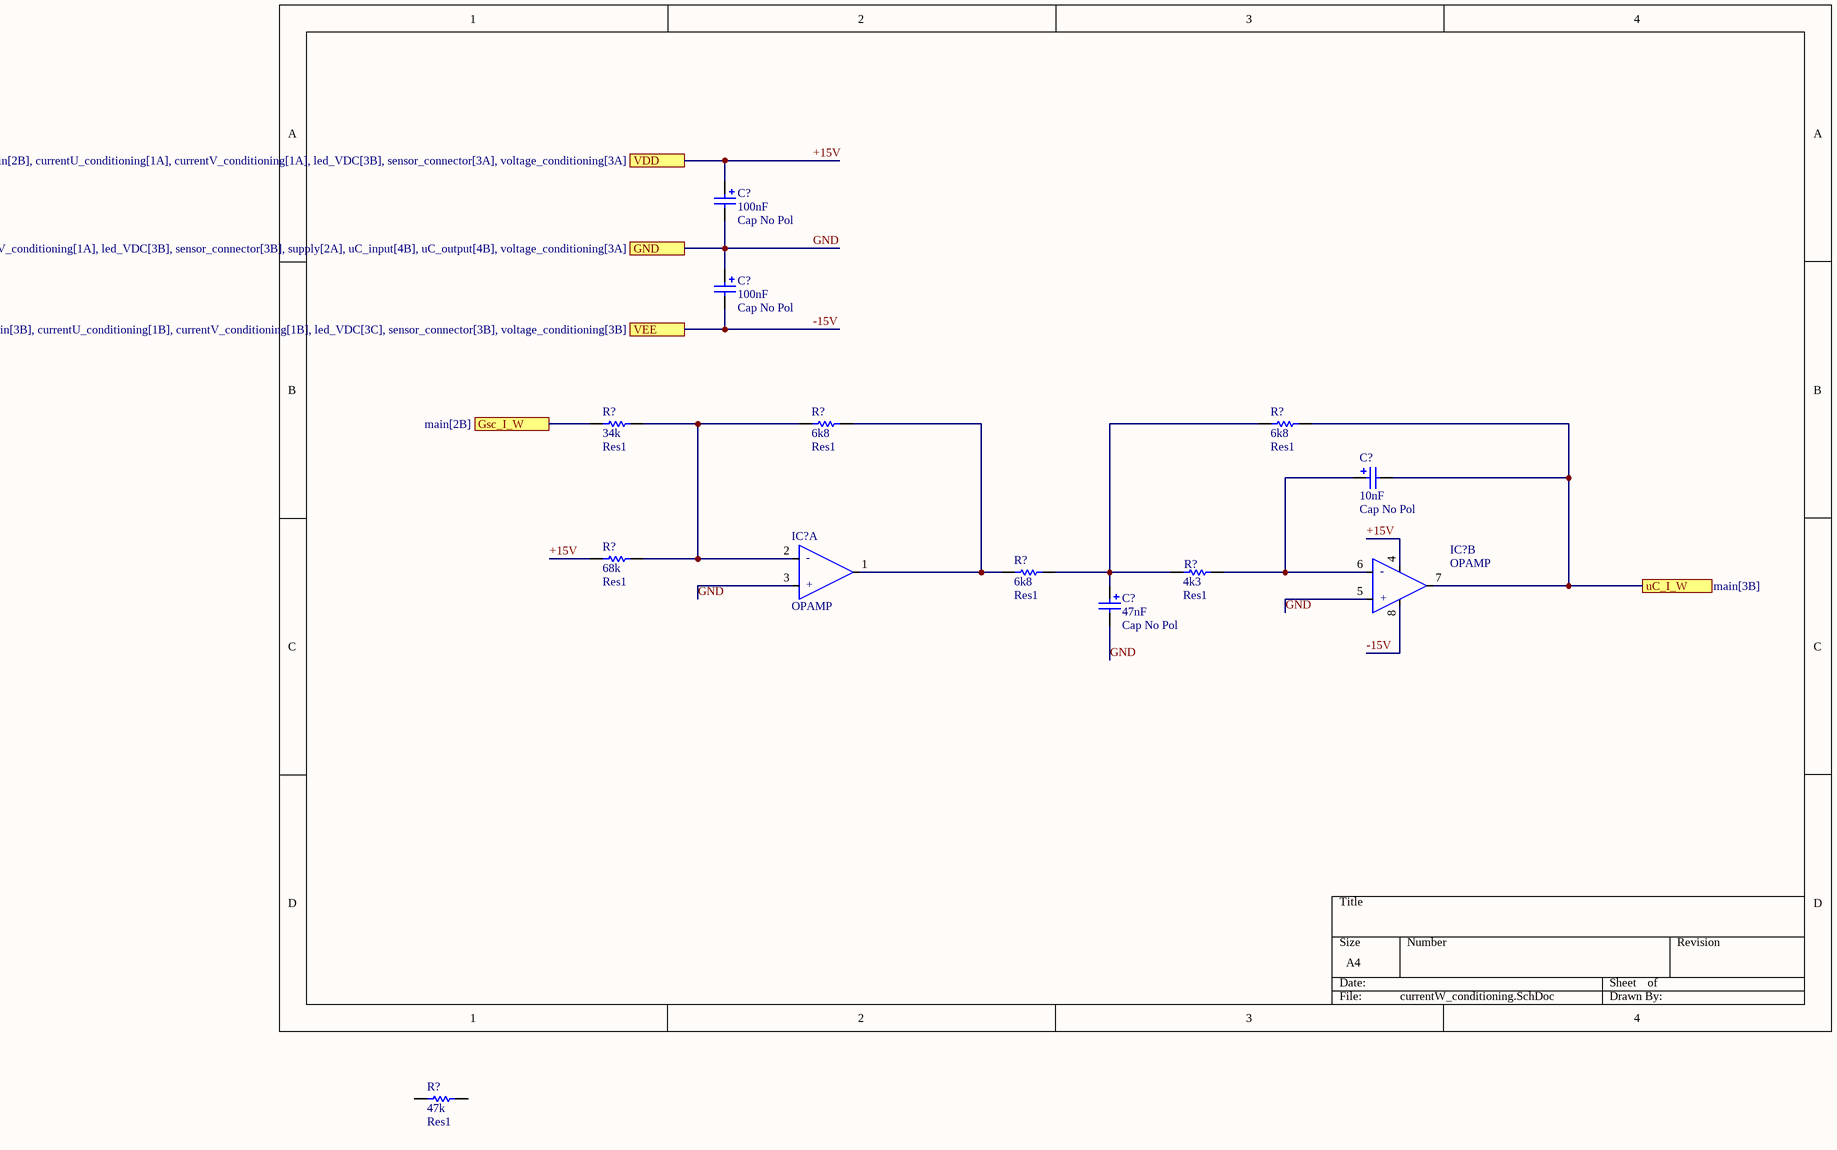
[diagram p9: currentW_conditioning.SchDoc]

### Parts
(Parts that share a designator on the sheet are numbered #1, #2 ... from top to bottom, then left to right.)
C?#14  Cap No Pol  value 100nF  [RAD-0.1]
C?#15  Cap No Pol  value 100nF  [RAD-0.1]
C?#16  Cap No Pol  value 10nF  [RAD-0.1]
C?#17  Cap No Pol  value 47nF  [RAD-0.1]
IC?#8  OPAMP  [DIP-8]  (part A of 2)
IC?#9  OPAMP  [DIP-8]  (part B of 2)
R?#37  Res1  value 34k  [AXIAL-0.3]
R?#38  Res1  value 6k8  [AXIAL-0.3]
R?#39  Res1  value 6k8  [AXIAL-0.3]
R?#40  Res1  value 68k  [AXIAL-0.3]
R?#41  Res1  value 6k8  [AXIAL-0.3]
R?#42  Res1  value 4k3  [AXIAL-0.3]
R?#43  Res1  value 47k  [AXIAL-0.3]

### Ports
GND (see main[3C], buffer[2A], control_connector[2D], currentU_conditioning[1A], currentV_conditioning[1A], led_VDC[3B], sensor_connector[3B], supply[2A], uC_input[4B], uC_output[4B], voltage_conditioning[3A]), Gsc_I_W (see main[2B]), uC_I_W (see main[3B]), VDD (see main[2B], currentU_conditioning[1A], currentV_conditioning[1A], led_VDC[3B], sensor_connector[3A], voltage_conditioning[3A]), VEE (see main[3B], currentU_conditioning[1B], currentV_conditioning[1B], led_VDC[3C], sensor_connector[3B], voltage_conditioning[3B])

### Nets
+15V: C?#14.1 IC?#9.4(-V) R?#40.1 ; port VDD
-15V: C?#15.2 IC?#9.8(V+) ; port VEE
GND: C?#14.2 C?#15.1 C?#17.2 IC?#8.3(IN_A_+) IC?#9.5(IN_B_+) ; port GND
A/D A5: C?#16.2 IC?#9.7(OUT_B) R?#39.2 ; port uC_I_W
NetC?#16_1: C?#16.1 IC?#9.6(IN_B_-) R?#42.2
NetC?#17_1: C?#17.1 R?#39.1 R?#41.2 R?#42.1
NetIC?#8_1: IC?#8.1(OUT_A) R?#38.2 R?#41.1
NetIC?#8_2: IC?#8.2(IN_A_-) R?#37.2 R?#38.1 R?#40.2
NetJ?#2_5: R?#37.1 ; port Gsc_I_W

Not connected (* = marked no-connect by the designer): R?#43 1 2

### Notes on the sheet
- (in symbol ADTL082, part A) -; +
- (in symbol ADTL082, part B) -; +

### Library data of the parts
C?#14-C?#17 = Cap No Pol: Polarized Capacitor (Radial); Published: 8-Jun-2000; LatestRevisionDate: 17-Jul-2002; LatestRevisionNote: Re-released for DXP Platform.; PackageReference: RB7.6-15; Publisher: Altium Limited; PackageDescription: Polarized Capacitor (Radial); 2 Leads
IC?#8 IC?#9 = ADTL082
R?#37-R?#43 = Res1: Resistor; Published: 8-Jun-2000; LatestRevisionDate: 17-Jul-2002; LatestRevisionNote: Re-released for DXP Platform.; PackageReference: AXIAL-0.3; Publisher: Altium Limited; PackageDescription: Axial Device, Thru-Hole; 2 Leads; 0.3 in Pin Spacing

## Sheet supply.SchDoc
size A4; SheetNumber: 9; SheetTotal: 12; SPICEModelCacheMDRHNIGR: <root> / <DocumentId>MDRHNIGR</DocumentId> / <CacheFrame Number="0"> / <Model Name="led0" Kind="MDL"> / <Text>*Typ INFRARED GaAs LED: Vf=1.2V Vr=5V If=40mA trr=3uS / *LED Pinout: 1=A, 2=K / .MODEL LED0 D (IS=93.5P RS=84M N=2.63 BV=5 IBV=10U / + CJO=2.97P VJ=.75 M=.333 TT=4.32U)</Text> / </Model> / <Model Name="1n4002" Kind="MDL"> / <Text>*1N4002 MCE 8-16-95 / *100V 1A Si GenPurpose Diode pkg:DIODE0.4 1,2 / .MODEL 1N4002 D(IS=2.55E-9 RS=0.042 N=1.75 TT=5.76E-6 CJO=1.85E-11 / + VJ=0.75 M=0.333 BV=100 IBV=1E-5 )</Text> / </Model> / </CacheFrame> / </root>
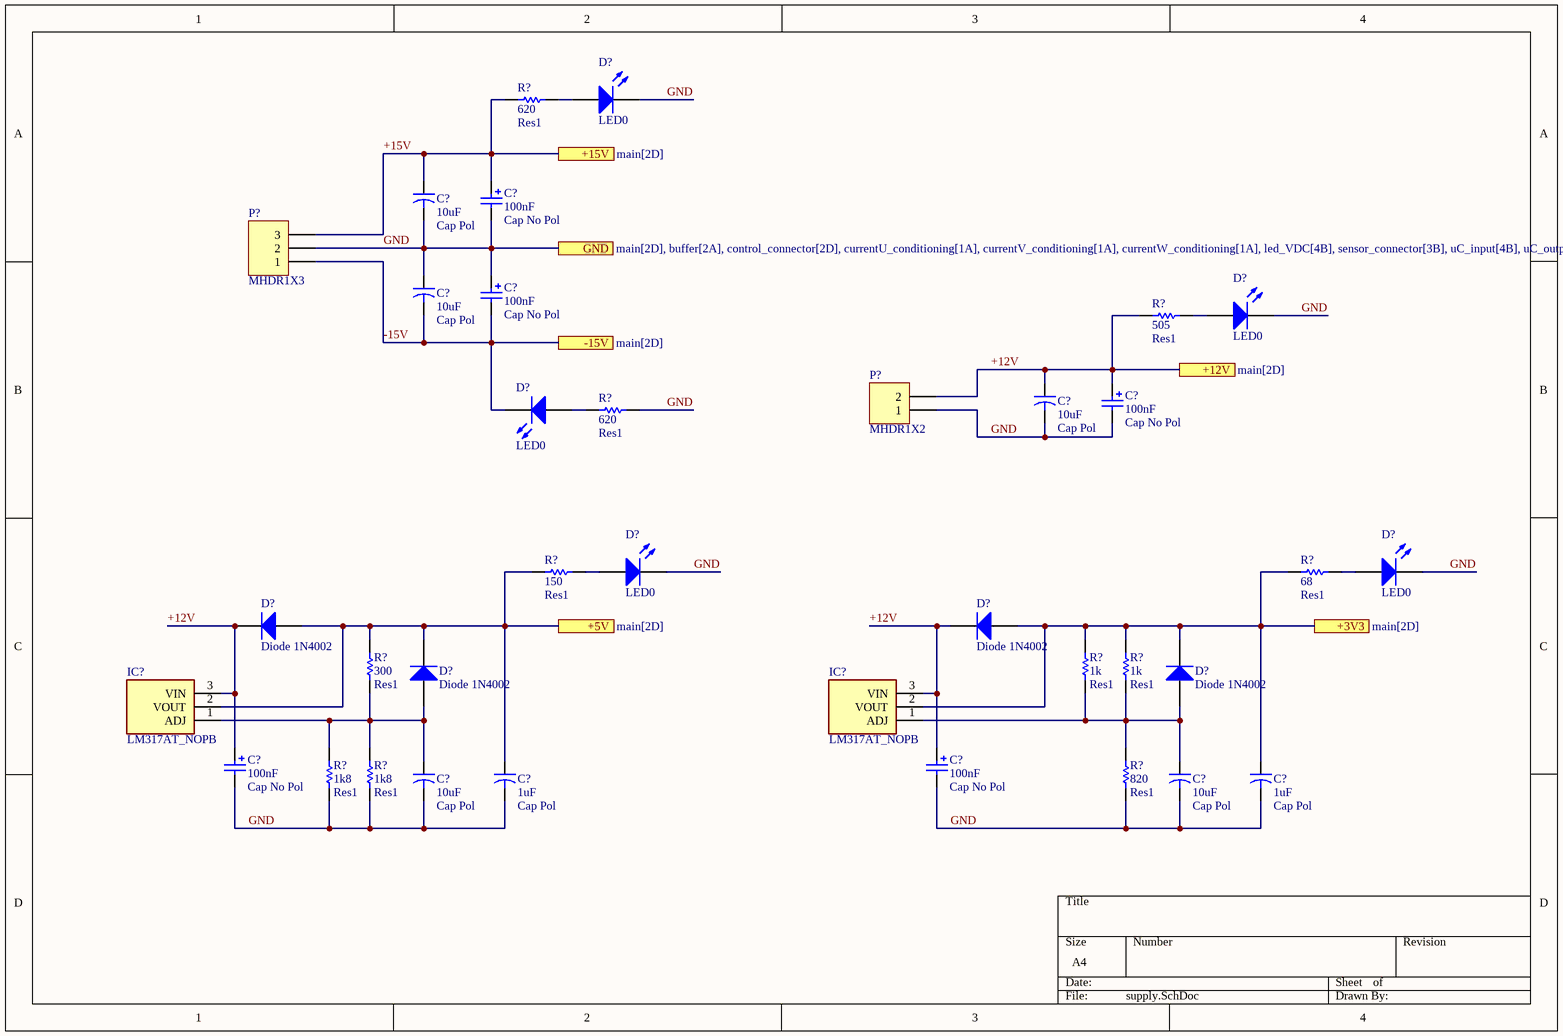
[diagram p10: supply.SchDoc]

### Parts
(Parts that share a designator on the sheet are numbered #1, #2 ... from top to bottom, then left to right.)
C?#18  Cap Pol  value 10uF  [CAPR5-4X5]
C?#19  Cap No Pol  value 100nF  [RAD-0.1]
C?#20  Cap Pol  value 10uF  [CAPR5-4X5]
C?#21  Cap No Pol  value 100nF  [RAD-0.1]
C?#22  Cap Pol  value 10uF  [CAPR5-4X5]
C?#23  Cap No Pol  value 100nF  [RAD-0.1]
C?#24  Cap No Pol  value 100nF  [RAD-0.1]
C?#25  Cap No Pol  value 100nF  [RAD-0.1]
C?#26  Cap Pol  value 10uF  [CAPR5-4X5]
C?#27  Cap Pol  value 1uF  [CAPR5-4X5]
C?#28  Cap Pol  value 10uF  [CAPR5-4X5]
C?#29  Cap Pol  value 1uF  [CAPR5-4X5]
D?#10  LED0  [LED-0]
D?#11  LED0  [LED-0]
D?#12  LED0  [LED-0]
D?#13  LED0  [LED-0]
D?#14  LED0  [LED-0]
D?#15  Diode 1N4002  [DO-41]
D?#16  Diode 1N4002  [DO-41]
D?#17  Diode 1N4002  [DO-41]
D?#18  Diode 1N4002  [DO-41]
IC?#10  LM317AT_NOPB  [TO254P470X1028X1955-3P]
IC?#11  LM317AT_NOPB  [TO254P470X1028X1955-3P]
P?#3  MHDR1X3  [MHDR1X3]
P?#4  MHDR1X2  [MHDR1X2]
R?#44  Res1  value 620  [AXIAL-0.3]
R?#45  Res1  value 505  [AXIAL-0.3]
R?#46  Res1  value 620  [AXIAL-0.3]
R?#47  Res1  value 150  [AXIAL-0.3]
R?#48  Res1  value 68  [AXIAL-0.3]
R?#49  Res1  value 300  [AXIAL-0.3]
R?#50  Res1  value 1k  [AXIAL-0.3]
R?#51  Res1  value 1k  [AXIAL-0.3]
R?#52  Res1  value 1k8  [AXIAL-0.3]
R?#53  Res1  value 1k8  [AXIAL-0.3]
R?#54  Res1  value 820  [AXIAL-0.3]

### Ports
+3V3 (see main[2D]), +5V (see main[2D]), +12V (see main[2D]), +15V (see main[2D]), -15V (see main[2D]), GND (see main[2D], buffer[2A], control_connector[2D], currentU_conditioning[1A], currentV_conditioning[1A], currentW_conditioning[1A], led_VDC[4B], sensor_connector[3B], uC_input[4B], uC_output[4B], voltage_conditioning[3A])

### Nets
+3V3: C?#29.1 D?#16.1(A) D?#18.2(K) IC?#11.2(VOUT) R?#48.1 R?#50.1 R?#51.1 ; port +3V3
+5V: C?#27.1 D?#15.1(A) D?#17.2(K) IC?#10.2(VOUT) R?#47.1 R?#49.1 ; port +5V
+12V: C?#22.1 C?#23.1 C?#24.1 C?#25.1 D?#15.2(K) D?#16.2(K) IC?#10.3(VIN) IC?#11.3(VIN) P?#4.2 R?#45.1 ; port +12V
+15V: C?#18.1 C?#19.1 P?#3.3 R?#44.1 ; port +15V
-15V: C?#20.2 C?#21.2 D?#12.2(K) P?#3.1 ; port -15V
GND: C?#19.2 C?#20.1 C?#21.1 C?#22.2 C?#23.2 C?#24.2 C?#25.2 C?#26.2 C?#27.2 C?#28.2 C?#29.2 D?#10.2(K) D?#11.2(K) D?#13.2(K) D?#14.2(K) P?#3.2 P?#4.1 R?#46.1 R?#52.2 R?#53.2 R?#54.2 ; port GND
NetC?#26_1: C?#26.1 D?#17.1(A) IC?#10.1(ADJ) R?#49.2 R?#52.1 R?#53.1
NetC?#28_1: C?#28.1 D?#18.1(A) IC?#11.1(ADJ) R?#50.2 R?#51.2 R?#54.1
NetD?#10_1: D?#10.1(A) R?#44.2
NetD?#11_1: D?#11.1(A) R?#45.2
NetD?#12_1: D?#12.1(A) R?#46.2
NetD?#13_1: D?#13.1(A) R?#47.2
NetD?#14_1: D?#14.1(A) R?#48.2

Not connected (* = marked no-connect by the designer): C?#18 2

### Library data of the parts
C?#18 C?#20 C?#22 C?#26-C?#29 = Cap Pol: Capacitor; Published: 23-Sep-2002; PackageReference: CAPR5-4X5; Publisher: Altium Limited; PackageDescription: Capacitor; 2 Leads
C?#19 C?#21 C?#23-C?#25 = Cap No Pol: Polarized Capacitor (Radial); Published: 8-Jun-2000; LatestRevisionDate: 17-Jul-2002; LatestRevisionNote: Re-released for DXP Platform.; PackageReference: RB7.6-15; Publisher: Altium Limited; PackageDescription: Polarized Capacitor (Radial); 2 Leads
D?#10-D?#14 = LED0: Typical INFRARED GaAs LED; Published: 8-Jun-2000; LatestRevisionDate: 08-Jul-2005; LatestRevisionNote: Mech Layer 1 removed.; PackageReference: LED-0; Publisher: Altium Limited; PackageDescription: LED; 2 Leads
D?#15-D?#18 = Diode 1N4002: 1 Amp General Purpose Rectifier; Published: 8-Jun-2000; LatestRevisionDate: 17-Jul-2002; LatestRevisionNote: Re-released for DXP Platform.; DatasheetVersion: 1998; PackageVersion: Aug-1999; PackageReference: DO-41; Publisher: Altium Limited; PackageDescription: Diode, Axial; Body 5.2 x 2.7 mm (LxDia. max), Lead Dia. 0.86 mm (max); Code_JEDEC: DO-204-AL; ComponentLink1Description: Manufacturer Link; ComponentLink1URL: http://www.fairchildsemi.com/; ComponentLink2Description: Datasheet; ComponentLink2URL: http://www.fairchildsemi.com/ds/1N%2F1N4001.pdf
IC?#10 IC?#11 = LM317AT_NOPB: Integrated Circuit; Manufacturer_Name: Texas Instruments; Manufacturer_Part_Number: LM317AT/NOPB; Datasheet Link: http://www.ti.com/lit/gpn/lm317a; Height: 4.7mm; Mouser Part Number: 926-LM317AT/NOPB; Mouser Price/Stock: https://www.mouser.co.uk/ProductDetail/Texas-Instruments/LM317AT-NOPB?qs=X1J7HmVL2ZFYFJRcNgsWcQ%3D%3D; Arrow Part Number: LM317AT/NOPB; Arrow Price/Stock: https://www.arrow.com/en/products/lm317atnopb/texas-instruments?region=nac
P?#3 = MHDR1X3: Header, 3-Pin; LatestRevisionDate: 17-Jul-2002; LatestRevisionNote: Re-released for DXP Platform.; Publisher: Altium Limited
P?#4 = MHDR1X2: Header, 2-Pin; LatestRevisionDate: 17-Jul-2002; LatestRevisionNote: Re-released for DXP Platform.; Publisher: Altium Limited
R?#44-R?#54 = Res1: Resistor; Published: 8-Jun-2000; LatestRevisionDate: 17-Jul-2002; LatestRevisionNote: Re-released for DXP Platform.; PackageReference: AXIAL-0.3; Publisher: Altium Limited; PackageDescription: Axial Device, Thru-Hole; 2 Leads; 0.3 in Pin Spacing

## Sheet led_VDC.SchDoc
size A; SheetNumber: 12; SheetTotal: 12; SPICEModelCacheQAAZNQEN: <root> / <DocumentId>QAAZNQEN</DocumentId> / <CacheFrame Number="0"> / <Model Name="led0" Kind="MDL"> / <Text>*Typ INFRARED GaAs LED: Vf=1.2V Vr=5V If=40mA trr=3uS / *LED Pinout: 1=A, 2=K / .MODEL LED0 D (IS=93.5P RS=84M N=2.63 BV=5 IBV=10U / + CJO=2.97P VJ=.75 M=.333 TT=4.32U)</Text> / </Model> / </CacheFrame> / </root>
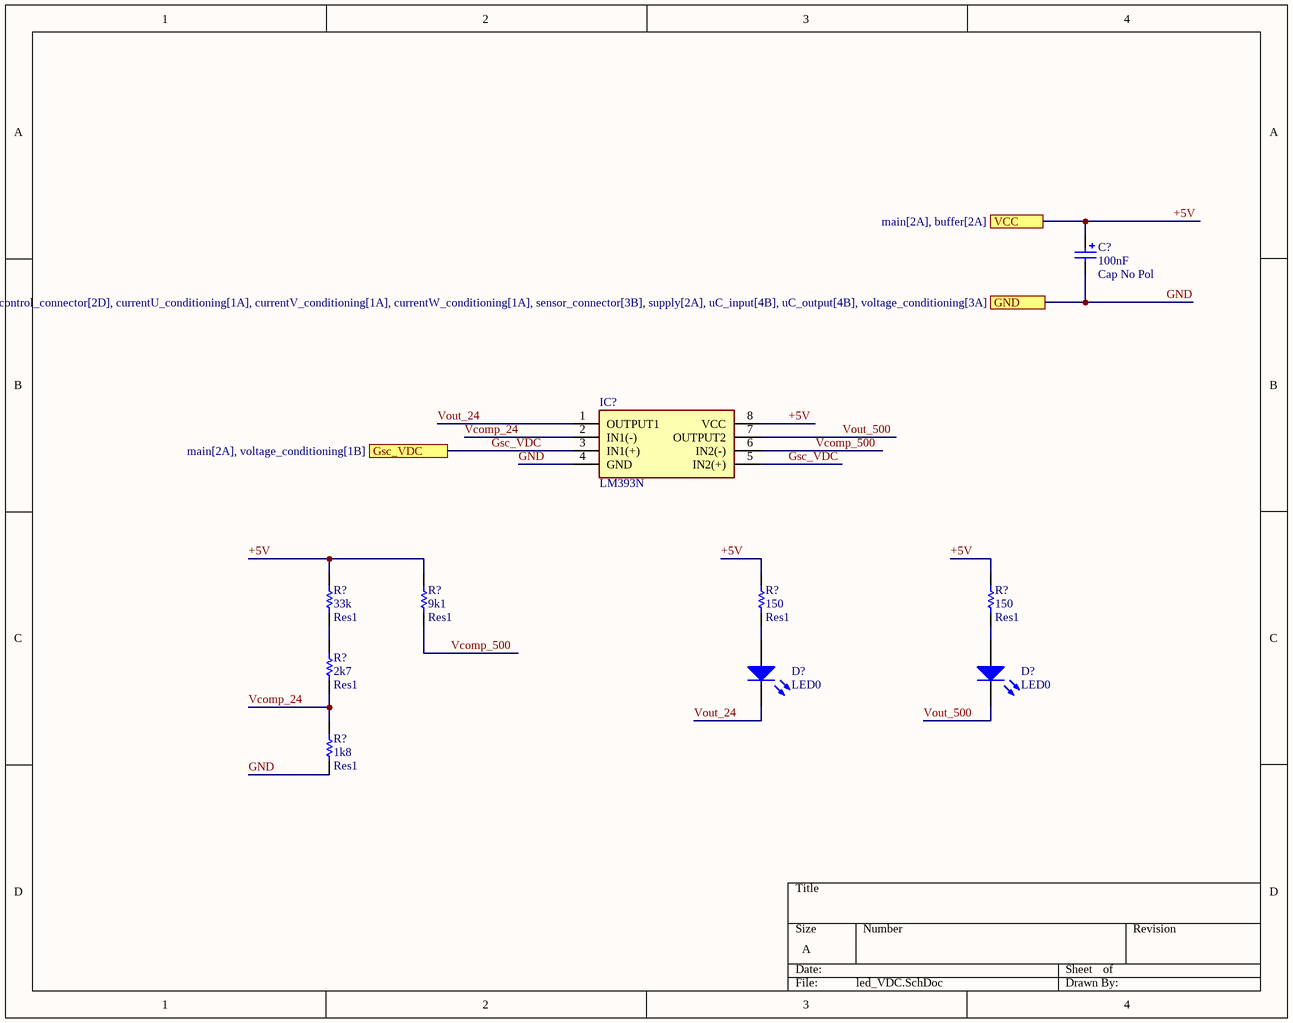
[diagram p11: led_VDC.SchDoc]

### Parts
(Parts that share a designator on the sheet are numbered #1, #2 ... from top to bottom, then left to right.)
C?#30  Cap No Pol  value 100nF  [RAD-0.1]
D?#19  LED0  [LED-0]
D?#20  LED0  [LED-0]
IC?#12  LM393N  [DIP787W53P254L980H533Q8N]
R?#55  Res1  value 33k  [AXIAL-0.3]
R?#56  Res1  value 9k1  [AXIAL-0.3]
R?#57  Res1  value 150  [AXIAL-0.3]
R?#58  Res1  value 150  [AXIAL-0.3]
R?#59  Res1  value 2k7  [AXIAL-0.3]
R?#60  Res1  value 1k8  [AXIAL-0.3]

### Ports
GND (see main[3A], buffer[2A], control_connector[2D], currentU_conditioning[1A], currentV_conditioning[1A], currentW_conditioning[1A], sensor_connector[3B], supply[2A], uC_input[4B], uC_output[4B], voltage_conditioning[3A]), Gsc_VDC (see main[2A], voltage_conditioning[1B]), VCC (see main[2A], buffer[2A])

### Nets
+5V: C?#30.1 IC?#12.8(VCC) R?#55.2 R?#56.2 R?#57.2 R?#58.2 ; port VCC
GND: C?#30.2 IC?#12.4(GND) R?#60.1 ; port GND
Gsc_VDC: IC?#12.3(IN1(+)) IC?#12.5(IN2(+)) ; port Gsc_VDC
Vcomp_24: IC?#12.2(IN1(-)) R?#59.1 R?#60.2
Vcomp_500: IC?#12.6(IN2(-)) R?#56.1
Vout_24: D?#19.2(K) IC?#12.1(OUTPUT1)
Vout_500: D?#20.2(K) IC?#12.7(OUTPUT2)
NetD?#19_1: D?#19.1(A) R?#57.1
NetD?#20_1: D?#20.1(A) R?#58.1
NetR?#55_1: R?#55.1 R?#59.2

### Library data of the parts
C?#30 = Cap No Pol: Polarized Capacitor (Radial); Published: 8-Jun-2000; LatestRevisionDate: 17-Jul-2002; LatestRevisionNote: Re-released for DXP Platform.; PackageReference: RB7.6-15; Publisher: Altium Limited; PackageDescription: Polarized Capacitor (Radial); 2 Leads
D?#19 D?#20 = LED0: Typical INFRARED GaAs LED; Published: 8-Jun-2000; LatestRevisionDate: 08-Jul-2005; LatestRevisionNote: Mech Layer 1 removed.; PackageReference: LED-0; Publisher: Altium Limited; PackageDescription: LED; 2 Leads
IC?#12 = LM393N: Integrated Circuit; Manufacturer_Name: Texas Instruments; Datasheet Link: https://datasheet.datasheetarchive.com/originals/distributors/Datasheets-SFU2/DSASFU100036444.pdf; Height: 5.33mm; Manufacturer_Part_Number: LM393N; Mouser Part Number: 926-LM393N; Mouser Price/Stock: https://www.mouser.co.uk/ProductDetail/Texas-Instruments/LM393N?qs=QbsRYf82W3HvgSG%252BWhL68w%3D%3D
R?#55-R?#60 = Res1: Resistor; Published: 8-Jun-2000; LatestRevisionDate: 17-Jul-2002; LatestRevisionNote: Re-released for DXP Platform.; PackageReference: AXIAL-0.3; Publisher: Altium Limited; PackageDescription: Axial Device, Thru-Hole; 2 Leads; 0.3 in Pin Spacing

## Nets that join several sheets
+3V3: buffer (R?#1.2), supply (7 pins)
+5V: buffer (C?#1.1 IC?#1.16), supply (6 pins), led_VDC (6 pins)
+12V: control_connector (J?#1.6 J?#1.15 J?#1.21 J?#1.24), supply (10 pins)
+15V: sensor_connector (J?#2.14 J?#2.15 J?#2.16), currentU_conditioning (C?#2.1 IC?#3.4 R?#19.1), voltage_conditioning (C?#6.1 IC?#5.4), currentV_conditioning (C?#10.1 IC?#7.4 R?#33.1), currentW_conditioning (C?#14.1 IC?#9.4 R?#40.1), supply (C?#18.1 C?#19.1 P?#3.3 R?#44.1)
-15V: sensor_connector (J?#2.23 J?#2.24 J?#2.25), currentU_conditioning (C?#3.2 IC?#3.8), voltage_conditioning (C?#7.2 IC?#5.8), currentV_conditioning (C?#11.2 IC?#7.8), currentW_conditioning (C?#15.2 IC?#9.8), supply (C?#20.2 C?#21.2 D?#12.2 P?#3.1)
GND: buffer (15 pins), control_connector (6 pins), currentU_conditioning (5 pins), voltage_conditioning (5 pins), uC_input (D?#3.1 D?#4.1 D?#8.1 D?#9.1), currentV_conditioning (5 pins), currentW_conditioning (5 pins), supply (21 pins), led_VDC (C?#30.2 IC?#12.4 R?#60.1)
A/D A2: voltage_conditioning (C?#8.2 IC?#5.7 R?#23.2), uC_input (D?#1.1 D?#3.2)
A/D A3: currentU_conditioning (C?#4.2 IC?#3.7 R?#17.2), uC_input (D?#6.1 D?#8.2)
A/D A4: uC_input (D?#2.1 D?#4.2), currentV_conditioning (C?#12.2 IC?#7.7 R?#32.2)
A/D A5: uC_input (D?#7.1 D?#9.2), currentW_conditioning (C?#16.2 IC?#9.7 R?#39.2)
Fault: control_connector (7 pins), uC_input (D?#5.2)
Gsc_VDC: voltage_conditioning (R?#24.1), led_VDC (IC?#12.3 IC?#12.5)
NetIC?#1_3: buffer (IC?#1.3 R?#3.2), control_connector (J?#1.3)
NetIC?#1_5: buffer (IC?#1.5 R?#7.2), control_connector (J?#1.20)
NetIC?#1_7: buffer (IC?#1.7 R?#11.2), control_connector (J?#1.14)
NetIC?#1_9: buffer (IC?#1.9 R?#13.2), control_connector (J?#1.23)
NetIC?#1_11: buffer (IC?#1.11 R?#9.2), control_connector (J?#1.17)
NetIC?#1_13: buffer (IC?#1.13 R?#5.2), control_connector (J?#1.12)
NetJ?#2_3: sensor_connector (J?#2.3), currentU_conditioning (R?#15.1 R?#18.1)
NetJ?#2_4: sensor_connector (J?#2.4), currentV_conditioning (R?#30.1)
NetJ?#2_5: sensor_connector (J?#2.5), currentW_conditioning (R?#37.1)